# EAGLE schematic RelojAzul (EAGLE 7.1.0)
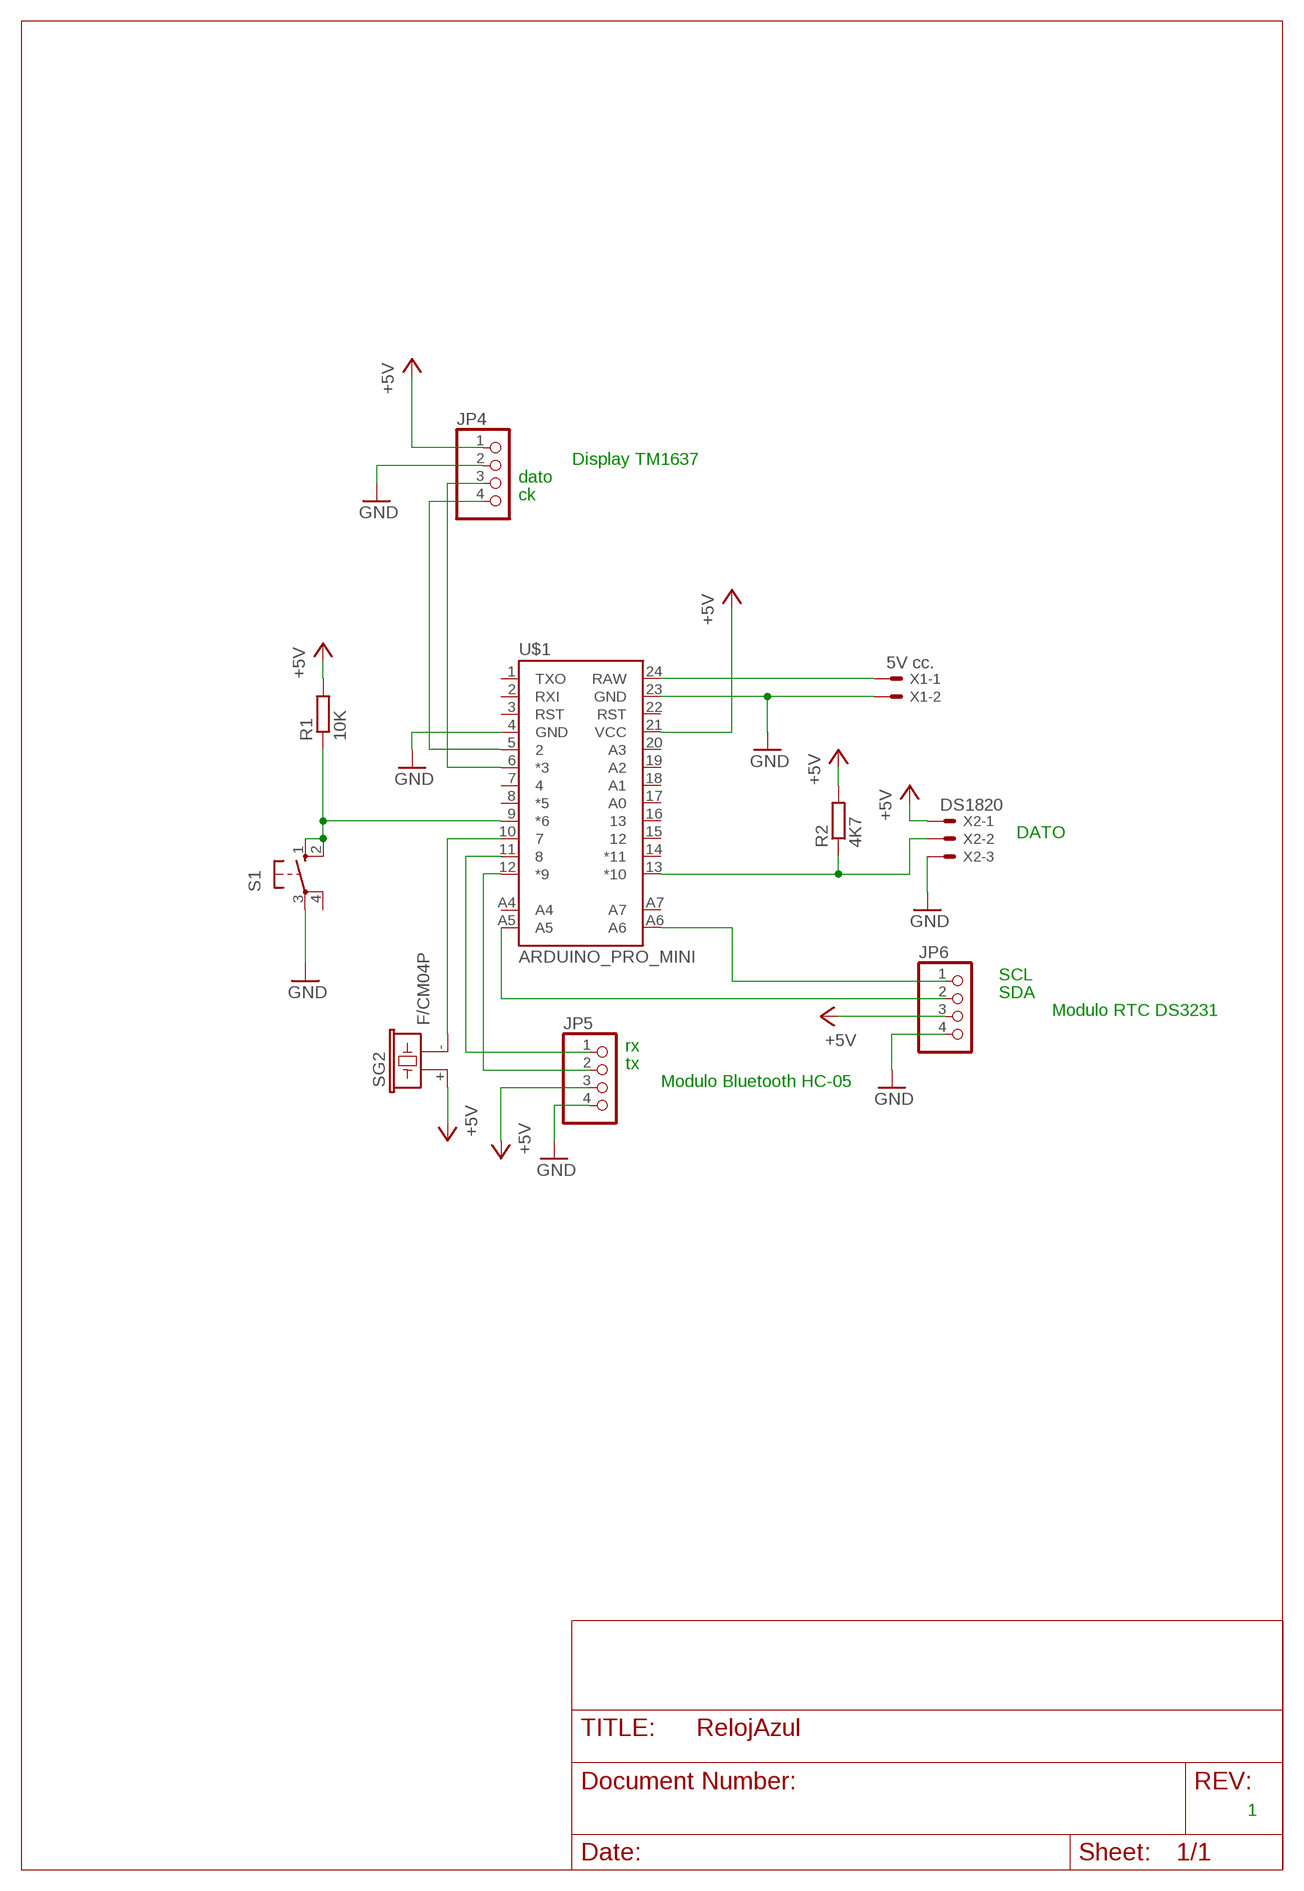
[diagram p0: schematic, sheet 1]

## Parts
JP4  PINHD-1X4  [1X04]
JP5  PINHD-1X4  [1X04]
JP6  PINHD-1X4  [1X04]
R1  10K  R-EU_0204_5  [0204/5]
R2  4K7  R-EU_0204_5  [0204/5]
S1  40-XX  [B3F-40XX]
SG2  F/CM04P  [F/CM04P]
U$1  ARDUINO_PRO_MINI  [ARDUINO_PRO_MINI]
X1  5V cc.  22-23-2021  [22-23-2021]
X2  DS1820  22-23-2031  [22-23-2031]

## Nets
+5V: JP4.1 JP5.3 JP6.3 R1.2 R2.2 SG2.+ U$1.21(VCC) X2.1
GND: JP4.2 JP5.4 JP6.4 S1.3(P) U$1.4(GND) U$1.23(GND) X1.2 X2.3
N$1: U$1.24(RAW) X1.1
N$2: R1.1 S1.1(S) S1.2(S1) U$1.9(*6)
N$3: SG2.- U$1.10
N$4: JP4.4 U$1.5
N$5: JP4.3 U$1.6(*3)
N$6: JP5.1 U$1.11
N$7: JP5.2 U$1.12(*9)
N$9: JP6.2 U$1.A5
N$10: JP6.1 U$1.A6
N$11: R2.1 U$1.13(*10) X2.2
Unconnected: S1.4(P1) U$1.1(TXO) U$1.2(RXI) U$1.3(RST) U$1.7 U$1.8(*5) U$1.14(*11) U$1.15 U$1.16 U$1.17(A0) U$1.18(A1) U$1.19(A2) U$1.20(A3) U$1.22(RST) U$1.A4 U$1.A7

## Notes on the sheet
- Display TM1637
- dato
- ck
- DATO
- SCL
- SDA
- Modulo RTC DS3231
- rx
- tx
- Modulo Bluetooth HC-05
- 1

## Library data of the parts
JP4-JP6 = pinhead:PINHD-1X4: PIN HEADER
R1 R2 = resistor:R-EU_: RESISTOR, European symbol; SPICEPREFIX: R
S1 = switch-omron:40-XX: OMRON SWITCH; MF: OMRON COMPONENTS USA; MPN: B3F-4000; OC_FARNELL: 176434; OC_NEWARK: 36K3105
SG2 = buzzer:F/CM04P: BUZZER Source: Buerklin; OC_FARNELL: unknown; OC_NEWARK: unknown
U$1 = SparkFun-Boards:ARDUINO_PRO_MINI
X1 = con-molex:22-23-2021: .100" (2.54mm) Center Header - 2 Pin; MF: MOLEX; MPN: 22-23-2021; OC_FARNELL: 1462926; OC_NEWARK: 25C3832
X2 = con-molex:22-23-2031: .100" (2.54mm) Center Header - 3 Pin; MF: MOLEX; MPN: 22-23-2031; OC_FARNELL: 1462950; OC_NEWARK: 30C0862